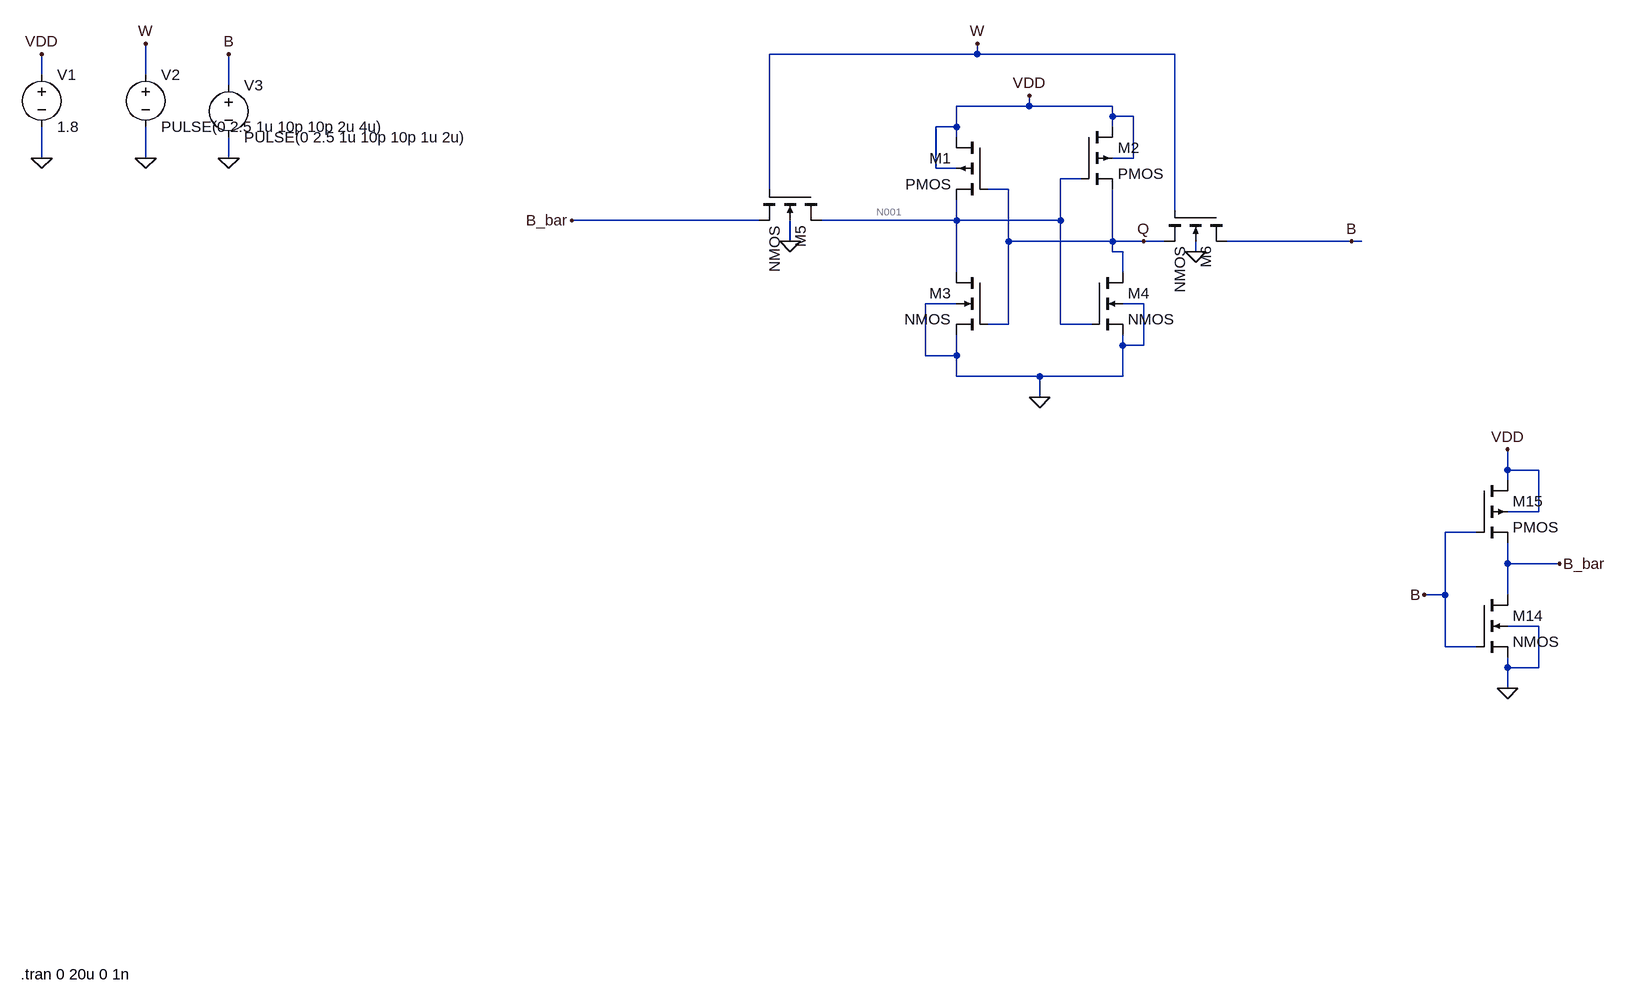
[diagram p0: schematic mSRAM.asc]
mSRAM.asc, the LTspice schematic file:
Version 4
SHEET 1 1384 1384
WIRE 224 -48 224 -64
WIRE 224 -48 -96 -48
WIRE 528 -48 224 -48
WIRE -1216 -16 -1216 -48
WIRE -1056 -16 -1056 -64
WIRE -928 0 -928 -48
WIRE 304 32 304 16
WIRE 304 32 192 32
WIRE 432 32 304 32
WIRE 432 48 432 32
WIRE 464 48 432 48
WIRE 192 64 192 32
WIRE 192 64 160 64
WIRE 432 64 432 48
WIRE 192 80 192 64
WIRE -1216 112 -1216 64
WIRE -1056 112 -1056 64
WIRE -928 112 -928 80
WIRE 464 112 464 48
WIRE 464 112 432 112
WIRE 160 128 160 64
WIRE 192 128 160 128
WIRE 384 144 352 144
WIRE -96 160 -96 -48
WIRE 272 160 240 160
WIRE 528 192 528 -48
WIRE -112 208 -400 208
WIRE 192 208 192 176
WIRE 192 208 -16 208
WIRE 352 208 352 144
WIRE 352 208 192 208
WIRE -64 240 -64 208
WIRE 272 240 272 160
WIRE 432 240 432 160
WIRE 432 240 272 240
WIRE 480 240 432 240
WIRE 512 240 480 240
WIRE 800 240 608 240
WIRE 816 240 800 240
WIRE 432 256 432 240
WIRE 448 256 432 256
WIRE 560 256 560 240
WIRE 192 288 192 208
WIRE 448 288 448 256
WIRE 192 336 144 336
WIRE 480 336 448 336
WIRE 272 368 272 240
WIRE 272 368 240 368
WIRE 352 368 352 208
WIRE 400 368 352 368
WIRE 448 400 448 384
WIRE 480 400 480 336
WIRE 480 400 448 400
WIRE 144 416 144 336
WIRE 192 416 192 384
WIRE 192 416 144 416
WIRE 192 448 192 416
WIRE 320 448 192 448
WIRE 448 448 448 400
WIRE 448 448 320 448
WIRE 320 480 320 448
WIRE 1040 592 1040 560
WIRE 1088 592 1040 592
WIRE 1040 608 1040 592
WIRE 1088 656 1088 592
WIRE 1088 656 1040 656
WIRE 992 688 944 688
WIRE 1040 736 1040 704
WIRE 1120 736 1040 736
WIRE 944 784 944 688
WIRE 944 784 912 784
WIRE 1040 784 1040 736
WIRE 1088 832 1040 832
WIRE 944 864 944 784
WIRE 992 864 944 864
WIRE 1040 896 1040 880
WIRE 1088 896 1088 832
WIRE 1088 896 1040 896
WIRE 1040 928 1040 896
FLAG 320 480 0
FLAG 304 16 VDD
FLAG -64 240 0
FLAG 560 256 0
FLAG 1040 560 VDD
FLAG 1040 928 0
FLAG 224 -64 W
FLAG -1216 -48 VDD
FLAG -1056 -64 W
FLAG -928 -48 B
FLAG -1216 112 0
FLAG -1056 112 0
FLAG -928 112 0
FLAG 800 240 B
FLAG -400 208 B_bar
FLAG 480 240 Q
FLAG 912 784 B
FLAG 1120 736 B_bar
SYMBOL pmos4 240 80 M0
SYMATTR InstName M1
SYMBOL pmos4 384 64 R0
SYMATTR InstName M2
SYMBOL nmos4 240 288 M0
SYMATTR InstName M3
SYMBOL nmos4 400 288 R0
SYMATTR InstName M4
SYMBOL nmos4 -16 160 R90
SYMATTR InstName M5
SYMBOL nmos4 608 192 R90
SYMATTR InstName M6
SYMBOL nmos4 992 784 R0
SYMATTR InstName M14
SYMBOL pmos4 992 608 R0
SYMATTR InstName M15
SYMBOL voltage -1216 -32 R0
WINDOW 123 0 0 Left 0
WINDOW 39 0 0 Left 0
SYMATTR InstName V1
SYMATTR Value 1.8
SYMBOL voltage -1056 -32 R0
WINDOW 123 0 0 Left 0
WINDOW 39 0 0 Left 0
SYMATTR InstName V2
SYMATTR Value PULSE(0 2.5 1u 10p 10p 2u 4u)
SYMBOL voltage -928 -16 R0
WINDOW 123 0 0 Left 0
WINDOW 39 0 0 Left 0
SYMATTR InstName V3
SYMATTR Value PULSE(0 2.5 1u 10p 10p 1u 2u)
TEXT -1248 1368 Left 2 !.tran 0 20u 0 1n

The netlist it stands for:
* mSRAM.asc
M1 VDD Q N001 VDD PMOS
M2 VDD N001 Q VDD PMOS
M3 N001 Q 0 0 NMOS
M4 Q N001 0 0 NMOS
M5 N001 W B_bar 0 NMOS
M6 B W Q 0 NMOS
M14 B_bar B 0 0 NMOS
M15 VDD B B_bar VDD PMOS
V1 VDD 0 1.8
V2 W 0 PULSE(0 2.5 1u 10p 10p 2u 4u)
V3 B 0 PULSE(0 2.5 1u 10p 10p 1u 2u)
.model NMOS NMOS
.model PMOS PMOS
.lib standard.mos
.tran 0 20u 0 1n
.backanno
.end

* Results of the author's LTspice run, read from the files saved beside the schematic
* Operating Point, zero values left out:
*   V(vdd) = 1.8 V
*   V(q) = 900 mV
*   V(n001) = 900 mV
*   V(b_bar) = 1.8 V
*   Id(M1) = 8.1 µA
*   Is(M1) = -8.1 µA
*   Id(M2) = 8.1 µA
*   Is(M2) = -8.1 µA
*   Id(M15) = 6.309 pA
*   Is(M15) = -6.309 pA
*   Id(M3) = 8.1 µA
*   Is(M3) = -8.1 µA
*   Id(M4) = 8.1 µA
*   Is(M4) = -8.1 µA
*   Ib(M5) = -2.72 pA
*   Is(M5) = 2.71 pA
*   Is(M6) = 1.81 pA
*   Id(M14) = 3.61 pA
*   Ib(M14) = -1.81 pA
*   Is(M14) = -1.8 pA
*   I(V1) = -16.2 µA
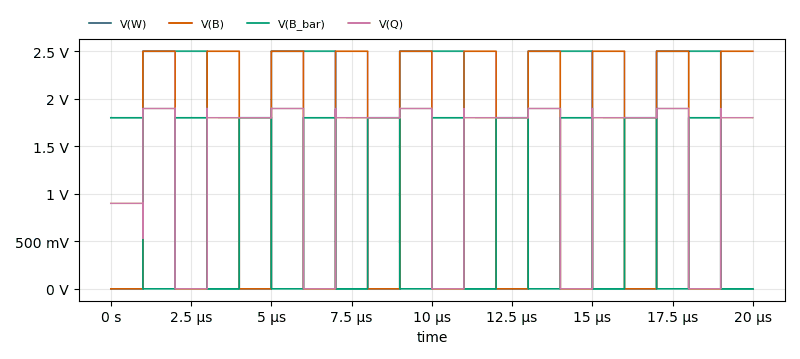
[diagram p1: Transient Analysis of mSRAM.asc, plotted from the saved traces]
* Transient Analysis, 1 run:
*   V(W): min 0 V, max 2.5 V, average 1.25 V, rms 1.768 V, last 0 V
*   V(B): min 0 V, max 2.5 V, average 1.25 V, rms 1.768 V, last 2.5 V
*   V(B_bar): min 0 V, max 1.801 V, average 900 mV, rms 1.273 V, last 0 V
*   V(Q): min 0 V, max 1.898 V, average 1.33 V, rms 1.549 V, last 1.8 V